# EAGLE schematic v1 (EAGLE 7.7.0)
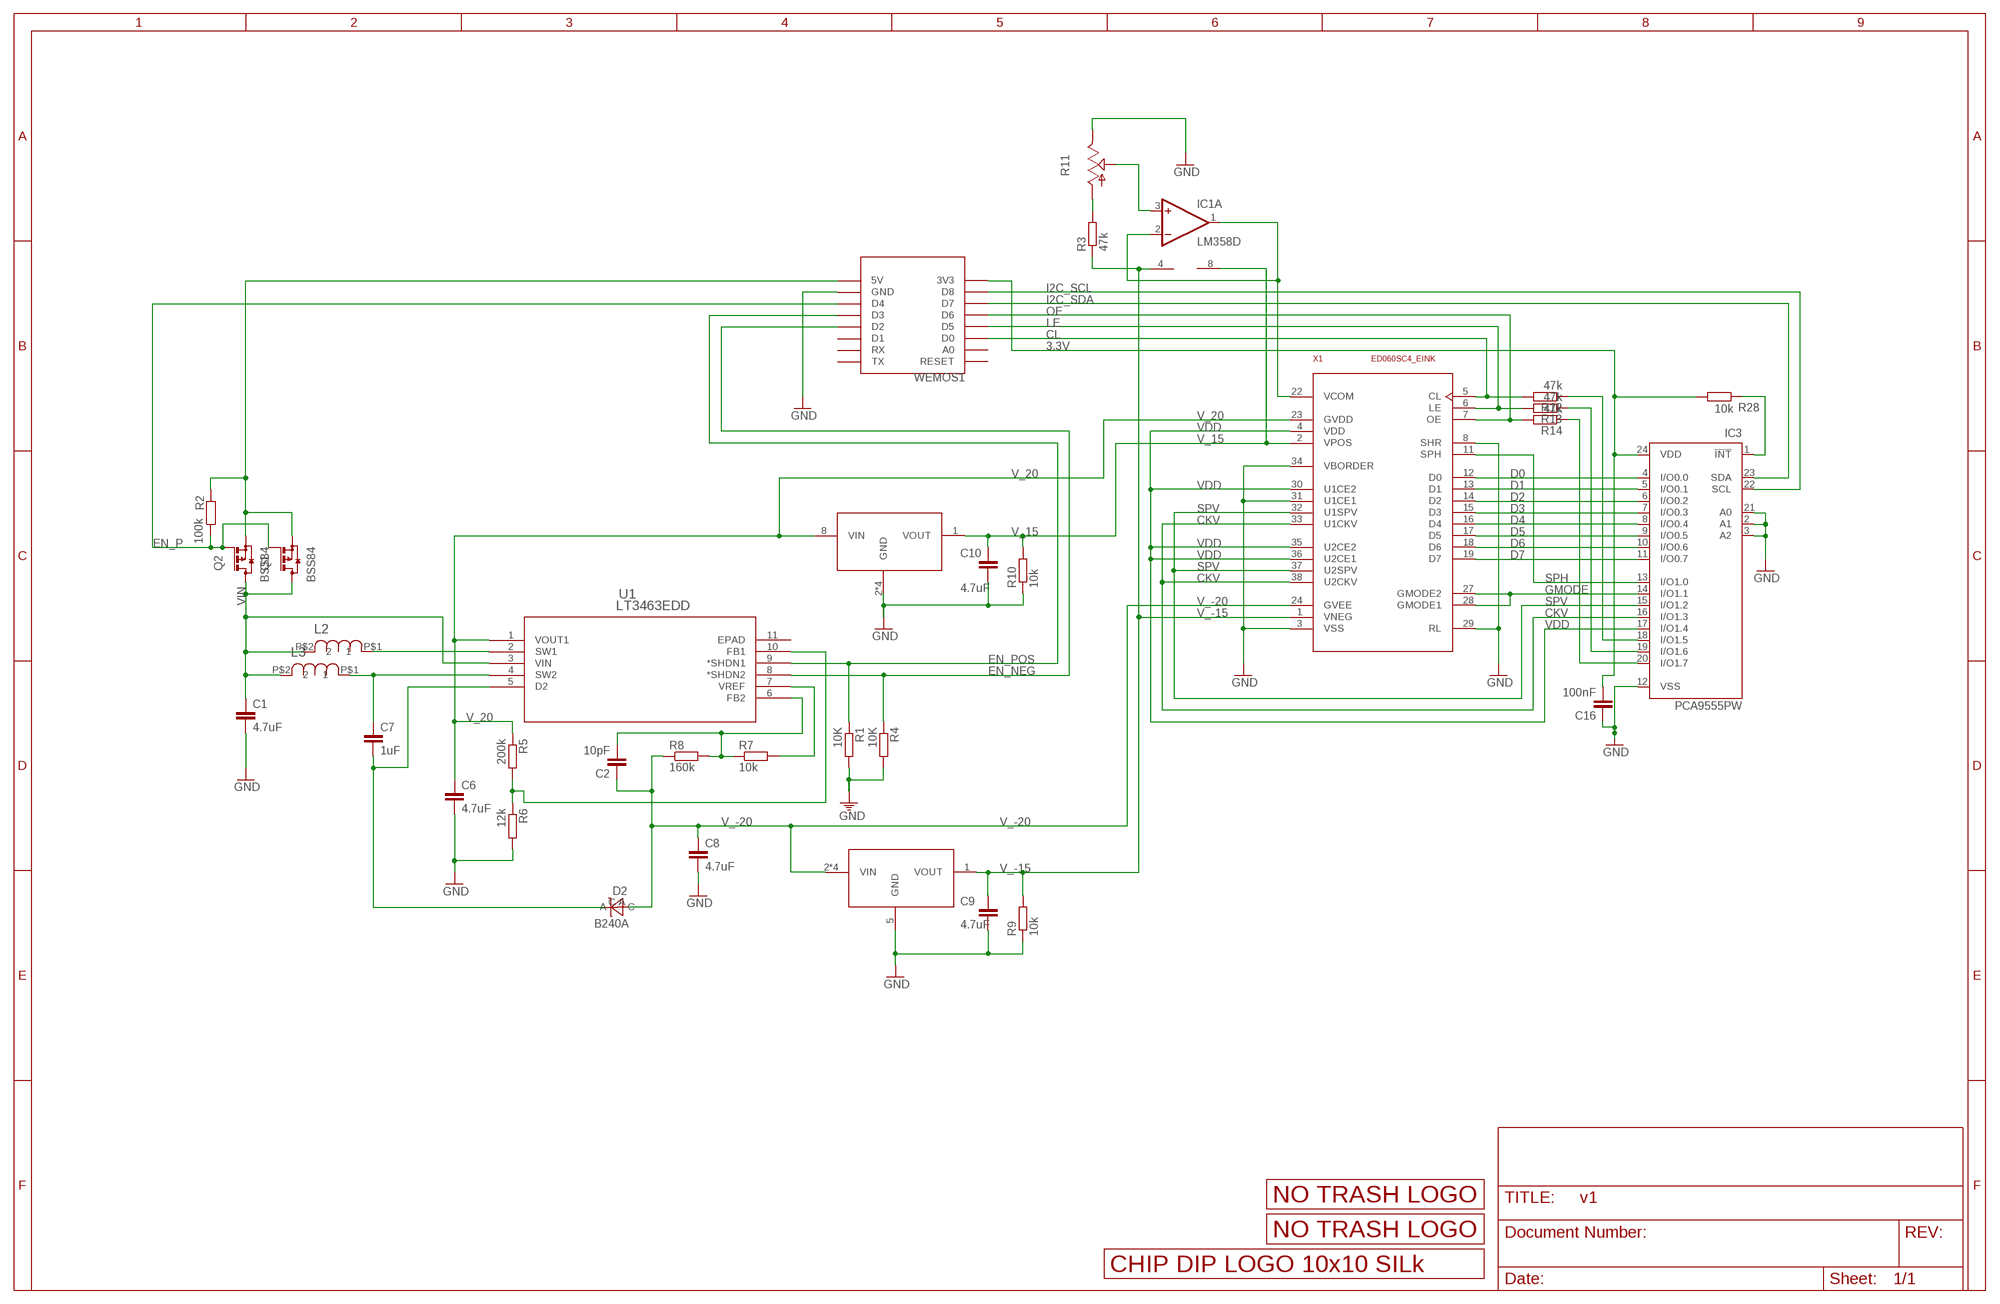
[diagram p0: schematic, sheet 1]

## Parts
C1  4.7uF  C-EUC0805  [C0805]
C2  10pF  C-EUC0805  [C0805]
C6  4.7uF  C-EUC0805  [C0805]
C7  1uF  C-EUC0805  [C0805]
C8  4.7uF  C-EUC0805  [C0805]
C9  4.7uF  C-EUC0805  [C0805]
C10  4.7uF  C-EUC0805  [C0805]
C16  100nF  C-EUC0805  [C0805]
D2  B240A  DIODE_SCHTKY_B240  [DO-214AC]
IC1  LM358D  [SO08]
IC3  PCA9555PW  [TSSOP24]
L2  SRN6045-100M  [SRN6045]
L3  SRN6045-100M  [SRN6045]
Q1  BSS84  [SOT23]
Q2  BSS84  [SOT23]
R1  10K  R-EU_M0805  [M0805]
R2  100k  R-EU_R0805  [R0805]
R3  47k  R-EU_M0805  [M0805]
R4  10K  R-EU_M0805  [M0805]
R5  200k  R-EU_M0805  [M0805]
R6  12k  R-EU_M0805  [M0805]
R7  10k  R-EU_M0805  [M0805]
R8  160k  R-EU_M0805  [M0805]
R9  10k  R-EU_M0805  [M0805]
R10  10k  R-EU_M0805  [M0805]
R11  TRIM_US-SM-42/43X  [SM-42/43X]
R12  47k  R-EU_M0805  [M0805]
R13  47k  R-EU_M0805  [M0805]
R14  47k  R-EU_M0805  [M0805]
R28  10k  R-EU_M0805  [M0805]
U1  LT3463EDD  [DFN-10_DD]
U$1  LM78L15ACMX  [SOIC127P600X175-8N]
U$2  LM79L15ACDG  [SOIC127P600X175-8N]
U$3  LOGO_10X10_SILK  [LOGO2_10X10_SILK]
U$4  LOGO_NO_TRASHNO_TRASH  [LOGO_ROHS_NO_TRASH]
U$5  LOGO_NO_TRASHROHS  [LOGO_ROHS_SYM]
WEMOS1  WEMOS-D1-MINI  [WEMOS-D1-MINI]
X1  ED060SC4_EINK  [FH26-39S-0.3SHW]

## Nets
3.3V: C16.2 IC3.24(VDD) R28.2 WEMOS1.3V3
CKV: IC3.16(I/O1.3) X1.33(U1CKV) X1.38(U2CKV)
CL: R12.2 WEMOS1.D0 X1.5(CL)
D0: IC3.4(I/O0.0) X1.12(D0)
D1: IC3.5(I/O0.1) X1.13(D1)
D2: IC3.6(I/O0.2) X1.14(D2)
D3: IC3.7(I/O0.3) X1.15(D3)
D4: IC3.8(I/O0.4) X1.16(D4)
D5: IC3.9(I/O0.5) X1.17(D5)
D6: IC3.10(I/O0.6) X1.18(D6)
D7: IC3.11(I/O0.7) X1.19(D7)
EN_NEG: R4.1 U1.8(*SHDN2) WEMOS1.D2
EN_P: Q1.1(G) Q2.1(G) R2.1 WEMOS1.D4
EN_POS: R1.1 U1.9(*SHDN1) WEMOS1.D3
GMODE: IC3.14(I/O1.1) X1.27(GMODE2) X1.28(GMODE1)
GND: C1.2 C6.2 C8.2 C9.2 C10.2 C16.1 IC3.2(A1) IC3.3(A2) IC3.12(VSS) IC3.21(A0) R1.2 R4.2 R6.2 R9.1 R10.1 R11.3(E) U$1.2(GND) U$1.3(GND) U$1.6(GND) U$1.7(GND) U$2.5(GND) WEMOS1.GND X1.3(VSS) X1.8(SHR) X1.29(RL) X1.31(U1CE1) X1.34(VBORDER)
I2C_SCL: IC3.22(SCL) WEMOS1.D8
I2C_SDA: IC3.23(SDA) WEMOS1.D7
KPD_INT: IC3.1(!INT) R28.1
LE: R13.2 WEMOS1.D5 X1.6(LE)
N$1: L2.P$1 U1.2(SW1)
N$2: C7.1 L3.P$1 U1.4(SW2)
N$3: R5.2 R6.1 U1.10(FB1)
N$7: C7.2 D2.C U1.5(D2)
N$8: C2.2 R7.1 R8.2 U1.6(FB2)
N$9: R7.2 U1.7(VREF)
N$15: IC1.1(A:OUT) IC1.2(A:-IN) X1.22(VCOM)
N$16: Q1.2(S) Q2.2(S) R2.2 WEMOS1.5V
N$17: R3.2 R11.1(A)
N$18: IC1.3(A:+IN) R11.2(S)
N$20: IC3.20(I/O1.7) R14.1
N$21: IC3.19(I/O1.6) R13.1
N$22: IC3.18(I/O1.5) R12.1
OE: R14.2 WEMOS1.D6 X1.7(OE)
SPH: IC3.13(I/O1.0) X1.11(SPH)
SPV: IC3.15(I/O1.2) X1.32(U1SPV) X1.37(U2SPV)
V_15: C10.1 IC1.8(P:V+) R10.2 U$1.1(VOUT) X1.2(VPOS)
V_20: C6.1 R5.1 U1.1(VOUT1) U$1.8(VIN) X1.23(GVDD)
V_-15: C9.1 IC1.4(P:V-) R3.1 R9.2 U$2.1(VOUT) X1.1(VNEG)
V_-20: C2.1 C8.1 D2.A R8.1 U$2.2(VIN) U$2.3(VIN) U$2.6(VIN) U$2.7(VIN) X1.24(GVEE)
VDD: IC3.17(I/O1.4) X1.4(VDD) X1.30(U1CE2) X1.35(U2CE2) X1.36(U2CE1)
VIN: C1.1 L2.P$2 L3.P$2 Q1.3(D) Q2.3(D) U1.3(VIN)
Unconnected: IC1.5(B:+IN) IC1.6(B:-IN) IC1.7(B:OUT) U1.11(EPAD) WEMOS1.A0 WEMOS1.D1 WEMOS1.RESET WEMOS1.RX WEMOS1.TX

## Library data of the parts
C1 C2 C6-C10 C16 = rcl:C-EU: CAPACITOR, European symbol
D2 = Keyboard v0_5:DIODE_SCHTKY_B240; DESCRIPTION: DIODE SMD General Purpose 400V 1A 1.4W RoHS DO-214AC; FOOTPRINT: DO-214AC; LINK: http://www.digikey.com/product-detail/en/B240A-13-F/B240A-FDICT-ND/717810; MFG: DIGIKEY; MFG_PN: B240A-FDICT-ND; PART_TYPE: DIODE; PRICE: 0.11; VENDOR: DIODES; VENDOR_PART_NUMBER: B240A-13-F
IC1 = linear:LM358: OP AMP also LM158; LM258; LM2904 Source: http://cache.national.com/ds/LM/LM158.pdf
IC3 = micro-philips:PCA9555: 16-bit I2C and SMBus I/O port with interrupt Source: PCA9555_5.pdf; MPN: PCA9555PW; OC_FARNELL: 1408297; OC_NEWARK: 63K6069
L2 L3 = Keyboard v0_5:SRN6045-100M; DESCRIPTION: power inductor 10uH 2.5A 58.6 mohm; FOOTPRINT: SRN6045; LINK: http://www.digikey.com/product-detail/en/SRN6045-100M/SRN6045-100MTR-ND/2756120; MFG: DIGIKEY; MFG_PN: SRN6045-100MTR-ND; PART_TYPE: IND; PRICE: 0.15; TOLLERANCE: ±20%; VENDOR: BOURNS; VENDOR_PART_NUMBER: SRN6045-100M
Q1 Q2 = transistor-small-signal:BSS84: P-CHANNEL MOS FET
R1-R10 R12-R14 R28 = rcl:R-EU_: RESISTOR, European symbol
R11 = pot:TRIM_US-: POTENTIOMETER
U1 = LT3463EDD:LT3463EDD; AVAILABILITY: Unavailable; DESCRIPTION: LT3463 - Dual Micropower DC/DC Converters with Schottky Diodes; MF: Linear Technology; MP: LT3463EDD; PACKAGE: DFN-10 Linear Technology; PRICE: None
U$1 = SOIC127P600X175-8N:LM78L15ACMX
U$2 = SOIC127P600X175-8N:LM79L15ACDG
U$3 = JKW_CHIP:LOGO_10X10_SILK
U$4 U$5 = JKW_CHIP:LOGO_NO_TRASH
WEMOS1 = esp8266modules:WEMOS-D1-MINI: WeMos.cc D1 mini ESP8266 module
X1 = hirose-flex:ED060SC4_EINK